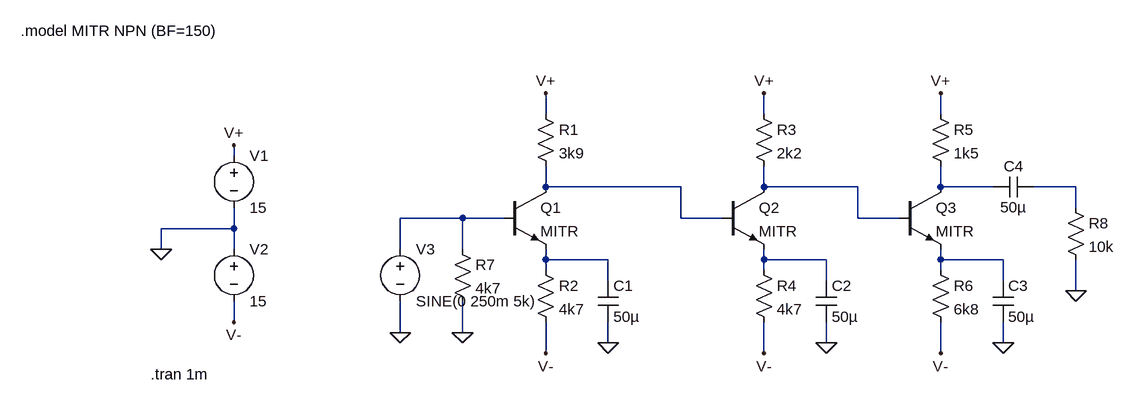
[diagram p0: schematic Ej#1.asc]
Ej#1.asc, the LTspice schematic file:
Version 4
SHEET 1 932 680
WIRE 48 -32 48 -64
WIRE 384 -32 384 -64
WIRE 656 -32 656 -64
WIRE -432 32 -432 16
WIRE 48 80 48 48
WIRE 256 80 48 80
WIRE 384 80 384 48
WIRE 528 80 384 80
WIRE 656 80 656 48
WIRE 736 80 656 80
WIRE 864 80 800 80
WIRE 864 112 864 80
WIRE -80 128 -176 128
WIRE -16 128 -80 128
WIRE 256 128 256 80
WIRE 320 128 256 128
WIRE 528 128 528 80
WIRE 592 128 528 128
WIRE -432 144 -432 112
WIRE -432 144 -544 144
WIRE -544 176 -544 144
WIRE -432 176 -432 144
WIRE -176 176 -176 128
WIRE -80 176 -80 128
WIRE 48 192 48 176
WIRE 144 192 48 192
WIRE 384 192 384 176
WIRE 480 192 384 192
WIRE 656 192 656 176
WIRE 752 192 656 192
WIRE 48 208 48 192
WIRE 384 208 384 192
WIRE 656 208 656 192
WIRE 144 224 144 192
WIRE 480 224 480 192
WIRE 752 224 752 192
WIRE 864 240 864 192
WIRE -432 288 -432 256
WIRE -176 304 -176 256
WIRE -80 304 -80 256
WIRE 144 320 144 288
WIRE 480 320 480 288
WIRE 752 320 752 288
WIRE 48 336 48 288
WIRE 384 336 384 288
WIRE 656 336 656 288
FLAG -544 176 0
FLAG -432 16 V+
FLAG 48 -64 V+
FLAG 144 320 0
FLAG 384 -64 V+
FLAG 480 320 0
FLAG 656 -64 V+
FLAG 752 320 0
FLAG 864 240 0
FLAG -80 304 0
FLAG -176 304 0
FLAG -432 288 V-
FLAG 48 336 V-
FLAG 384 336 V-
FLAG 656 336 V-
SYMBOL npn -16 80 R0
SYMATTR InstName Q1
SYMATTR Value MITR
SYMBOL voltage -432 16 R0
WINDOW 123 0 0 Left 0
WINDOW 39 0 0 Left 0
SYMATTR InstName V1
SYMATTR Value 15
SYMBOL voltage -432 160 R0
WINDOW 123 0 0 Left 0
WINDOW 39 0 0 Left 0
SYMATTR InstName V2
SYMATTR Value 15
SYMBOL res 32 -48 R0
SYMATTR InstName R1
SYMATTR Value 3k9
SYMBOL res 32 192 R0
SYMATTR InstName R2
SYMATTR Value 4k7
SYMBOL cap 128 224 R0
SYMATTR InstName C1
SYMATTR Value 50µ
SYMBOL npn 320 80 R0
SYMATTR InstName Q2
SYMATTR Value MITR
SYMBOL res 368 -48 R0
SYMATTR InstName R3
SYMATTR Value 2k2
SYMBOL res 368 192 R0
SYMATTR InstName R4
SYMATTR Value 4k7
SYMBOL cap 464 224 R0
SYMATTR InstName C2
SYMATTR Value 50µ
SYMBOL npn 592 80 R0
SYMATTR InstName Q3
SYMATTR Value MITR
SYMBOL res 640 -48 R0
SYMATTR InstName R5
SYMATTR Value 1k5
SYMBOL res 640 192 R0
SYMATTR InstName R6
SYMATTR Value 6k8
SYMBOL cap 736 224 R0
SYMATTR InstName C3
SYMATTR Value 50µ
SYMBOL res -96 160 R0
SYMATTR InstName R7
SYMATTR Value 4k7
SYMBOL voltage -176 160 R0
WINDOW 123 0 0 Left 0
WINDOW 39 0 0 Left 0
SYMATTR InstName V3
SYMATTR Value SINE(0 250m 5k)
SYMBOL cap 800 64 R90
WINDOW 0 0 32 VBottom 2
WINDOW 3 32 32 VTop 2
SYMATTR InstName C4
SYMATTR Value 50µ
SYMBOL res 848 96 R0
SYMATTR InstName R8
SYMATTR Value 10k
TEXT -760 -160 Left 2 !.model MITR NPN (BF=150)
TEXT -560 368 Left 2 !.tran 1m

The netlist it stands for:
* Ej#1.asc
Q1 N001 N005 N006 0 MITR
V1 V+ 0 15
V2 0 V- 15
R1 V+ N001 3k9
R2 N006 V- 4k7
C1 N006 0 50µ
Q2 N002 N001 N007 0 MITR
R3 V+ N002 2k2
R4 N007 V- 4k7
C2 N007 0 50µ
Q3 N003 N002 N008 0 MITR
R5 V+ N003 1k5
R6 N008 V- 6k8
C3 N008 0 50µ
R7 N005 0 4k7
V3 N005 0 SINE(0 250m 5k)
C4 N004 N003 50µ
R8 N004 0 10k
.model NPN NPN
.model PNP PNP
.lib standard.bjt
.model MITR NPN (BF=150)
.tran 1m
.backanno
.end